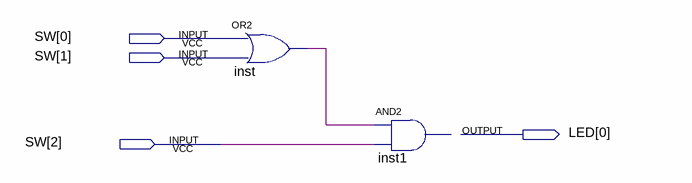
[diagram p0: schematic sheet]
// Quartus schematic ytjf.bdf as structural Verilog: 2 symbols, 4 pins
module ytjf (
  input  [2:0] SW,
  output [0:0] LED
);

  wire inst_out;

  or inst (inst_out, SW[0], SW[1]);
  // AND2 inst1 has open pins: IN1=inst_out, IN2=SW[2], OUT=open
endmodule
